# EAGLE design muxpmod (EAGLE 9.3.1)
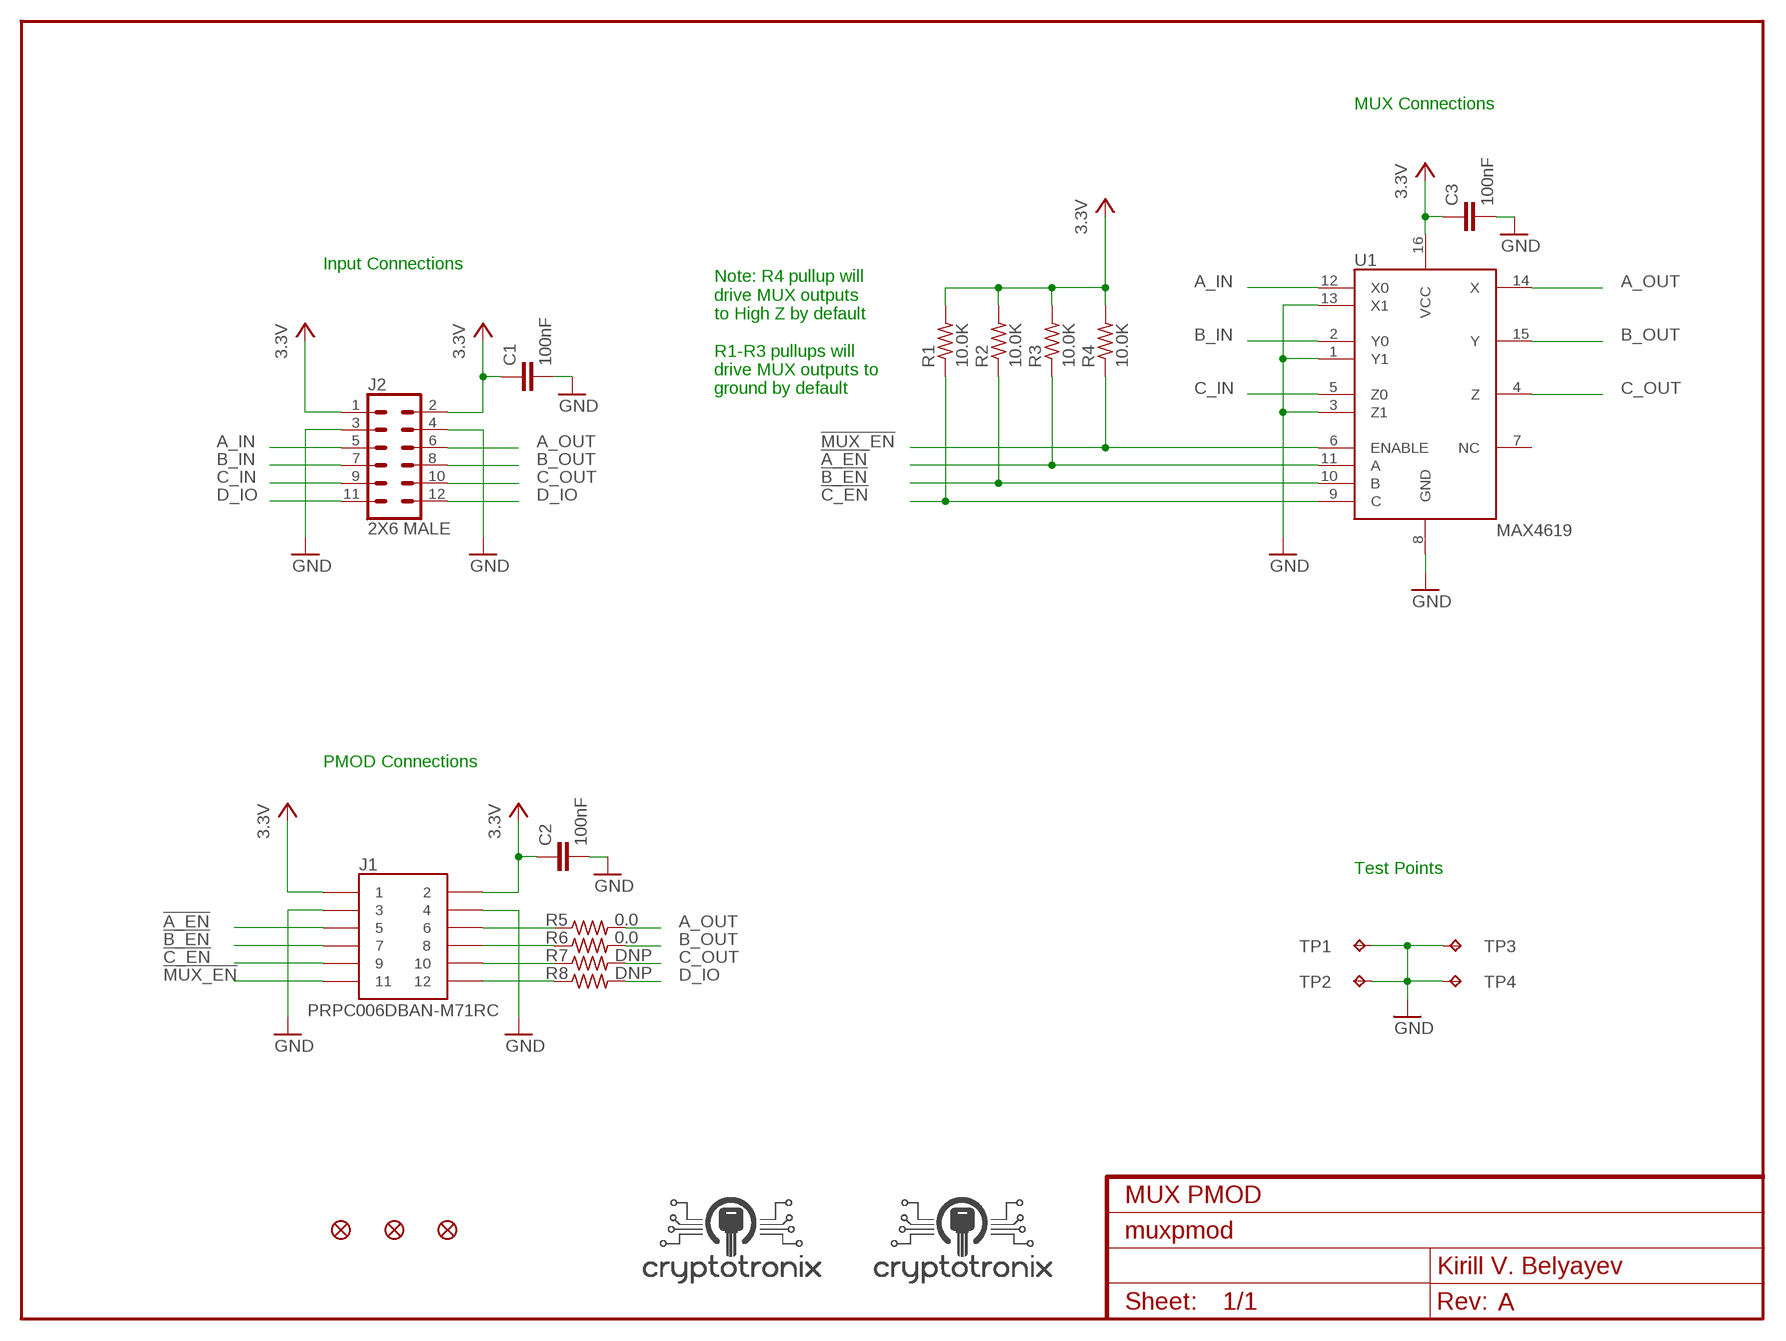
[diagram p0: schematic, sheet 1]
FRAME1 (FRAME-LETTER): CNAME: MUX PMOD; CREVISION: A; DESIGNER: Kirill V. Belyayev

## Parts
C1  100nF  C-EUC0603  [C0603]
C2  100nF  C-EUC0603  [C0603]
C3  100nF  C-EUC0603  [C0603]
FD1  FIDUCIALUFIDUCIAL  [MICRO-FIDUCIAL]
FD2  FIDUCIALUFIDUCIAL  [MICRO-FIDUCIAL]
FD3  FIDUCIALUFIDUCIAL  [MICRO-FIDUCIAL]
J1  PRPC006DBAN-M71RC  [PRPC006DBAN-M71RC]
J2  2X6 MALE  CONN_06X2PTH_FEMALE  [2X6]
LOGO1  CRYPTOTRONIX_LOGO_S  [CRYPTOTRONIX_LOGO_S]
LOGO2  CRYPTOTRONIX_LOGO_S  [CRYPTOTRONIX_LOGO_S]
R1  10.0K  R-US_R0603  [R0603]
R2  10.0K  R-US_R0603  [R0603]
R3  10.0K  R-US_R0603  [R0603]
R4  10.0K  R-US_R0603  [R0603]
R5  0.0  R-US_R0603  [R0603]
R6  0.0  R-US_R0603  [R0603]
R7  DNP  R-US_R0603  [R0603]
R8  DNP  R-US_R0603  [R0603]
TP1  TEST-POINT-SM  [5015]
TP2  TEST-POINT-SM  [5015]
TP3  TEST-POINT-SM  [5015]
TP4  TEST-POINT-SM  [5015]
U1  MAX4619  [16SOIC]

## Nets
0V: C1.2 C2.2 C3.2 J1.3 J1.4 J2.3 J2.4 TP1.1(PP) TP2.1(PP) TP3.1(PP) TP4.1(PP) U1.1(Y1) U1.3(Z1) U1.8(GND) U1.13(X1) ; supply symbol labelled GND
3.3V: C1.1 C2.1 C3.1 J1.1 J1.2 J2.1 J2.2 R1.2 R2.2 R3.2 R4.2 U1.16(VCC)
!A_EN: J1.5 R3.1 U1.11(A)
!B_EN: J1.7 R2.1 U1.10(B)
!C_EN: J1.9 R1.1 U1.9(C)
!MUX_EN: J1.11 R4.1 U1.6(ENABLE)
A_IN: J2.5 U1.12(X0)
A_OUT: J2.6 R5.2 U1.14(X)
B_IN: J2.7 U1.2(Y0)
B_OUT: J2.8 R6.2 U1.15(Y)
C_IN: J2.9 U1.5(Z0)
C_OUT: J2.10 R7.2 U1.4(Z)
D_IO: J2.11 J2.12 R8.2
N$1: J1.6 R5.1
N$2: J1.8 R6.1
N$3: J1.10 R7.1
N$4: J1.12 R8.1
Unconnected: U1.7(NC)

## Notes on the sheet
- MUX Connections
- Input Connections
- Note: R4 pullup will
  drive MUX outputs 
  to High Z by default
  
  R1-R3 pullups will
  drive MUX outputs to
  ground by default
- PMOD Connections
- Test Points

## Library data of the parts
C1-C3 = rcl:C-EU: CAPACITOR, European symbol; SPICEPREFIX: C
FD1-FD3 = KVB-misc:FIDUCIAL: Fiducial Alignment Points Various fiducial points for machine vision alignment.
J1 = KVB-connectors:PRPC006DBAN-M71RC: Connector Header Through Hole Right Angle 12 position 0.100" (2.54mm); MAN-PART_NUM: PRPC006DBAN-M71RC; MANUFACTURER: Sullins
J2 = SparkFun-Connectors:CONN_06X2: Multi connection point. Often used as Generic Header-pin footprint for 0.1 inch spaced/style header connections On any of the 0.1 inch spaced packages, you can populate with these: Break Away Headers - Straight <https://www.sparkfun.com/products/116> (PRT-00116) Break Away Male Headers - Right Angle <https://www.sparkfun.com/products/553> (PRT-00553) Female Headers <https://www.sparkfun.com/products/115> (PRT-00115) Break Away Headers - Machine Pin <https://www.sparkfun.com/products/117> (PRT-00117) Break Away Female Headers - Swiss Machine Pin <https://www.sparkfun.com/products/743> (PRT-00743); PROD_ID: CONN-12423; VALUE: 2X6 FEMALE
LOGO1 LOGO2 = KVB-misc:CRYPTOTRONIX_LOGO: Cryptotronix Logo
R1-R8 = rcl:R-US_: RESISTOR, American symbol; SPICEPREFIX: R
TP1-TP4 = KVB-misc:TEST-POINT: Various Test Points; MAN-PART_NUM: 5015; MANUFACTURER: KEYSTONE
U1 = KVB-ICs:MAX4619: IC MUX/SW TRIPLE LV SPDT 16-SOIC; MAN-PART_NUM: MAX4619CSE+; MANUFACTURER: Maxim Integrated

## Board
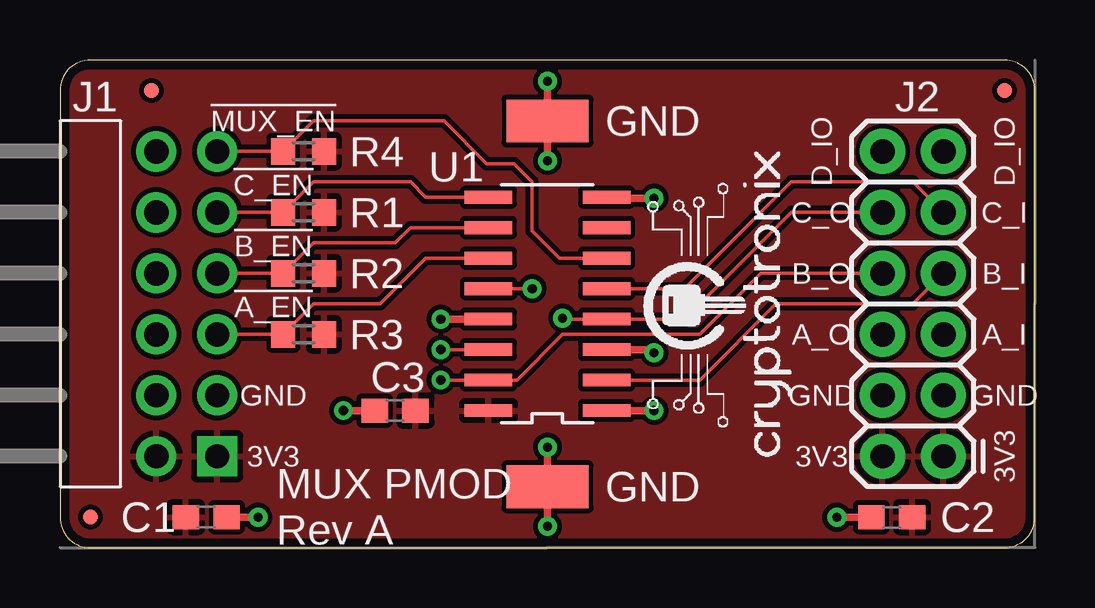
[diagram p1: board, top side]
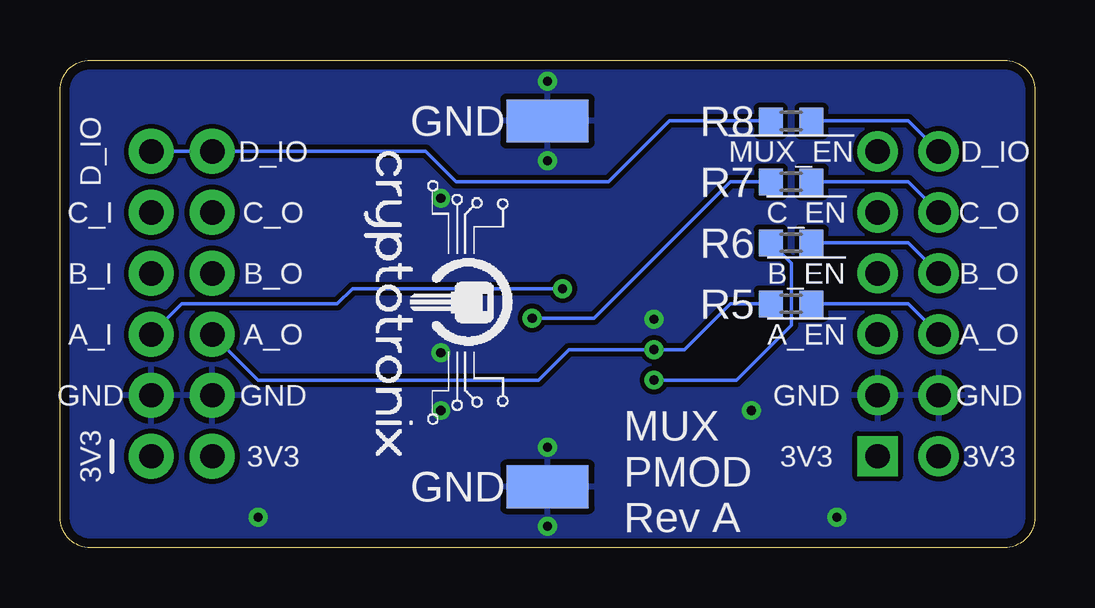
[diagram p2: board, bottom side, seen from below]

Size 40.64 x 20.32 mm. Coordinates in mm from the lower left corner, seen from the top.
Outline: 0,19.05 0,1.27 arc90 1.27,0 39.37,0 arc90 40.64,1.27 40.64,19.05 arc90 39.37,20.32 1.27,20.32 arc90 0,19.05
Copper layers (1*16): Top 0.035mm / dielectric 1.5mm / Bottom 0.035mm
Design rules "KVB-2layer": minimum track width 6mil, minimum drill 15mil, track to track 8mil, track to pad 8mil, pad to pad 8mil, via to via 8mil, smd to smd 8mil, copper to edge 15mil, drill to drill 8mil, minimum pad ring 10mil, minimum via ring 8mil, stop-mask expansion 3mil, vias tented up to drill 0mil, thermal gap 10mil

### Footprints (pad centres in the part's own frame; a part is rotated, then mirrored left to right if it is on the bottom)
C0603 = smd 1.1 x 1: 1 -0.85,0; 2 0.85,0
MICRO-FIDUCIAL = smd 0.635 x 0.635: 1 0,0
PRPC006DBAN-M71RC = drill 1.016 pad 1.676 square: 1 -6.553,6.35 | drill 1.016 pad 1.676: 2 -4.013,6.35; 3 -6.553,3.81; 4 -4.013,3.81; 5 -6.553,1.27; 6 -4.013,1.27; 7 -6.553,-1.27; 8 -4.013,-1.27; 9 -6.553,-3.81; 10 -4.013,-3.81; 11 -6.553,-6.35; 12 -4.013,-6.35
2X6 = drill 1.016 pad 1.88: 1 0,0; 2 0,2.54; 3 2.54,0; 4 2.54,2.54; 5 5.08,0; 6 5.08,2.54; 7 7.62,0; 8 7.62,2.54; 9 10.16,0; 10 10.16,2.54; 11 12.7,0; 12 12.7,2.54
R0603 = smd 1 x 1.1: 1 -0.85,0; 2 0.85,0
5015 = smd 1.778 x 3.429: 1 0,0
16SOIC = smd 1.981 x 0.533: 1 -2.464,4.445; 2 -2.464,3.175; 3 -2.464,1.905; 4 -2.464,0.635; 5 -2.464,-0.635; 6 -2.464,-1.905; 7 -2.464,-3.175; 8 -2.464,-4.445; 9 2.464,-4.445; 10 2.464,-3.175; 11 2.464,-1.905; 12 2.464,-0.635; 13 2.464,0.635; 14 2.464,1.905; 15 2.464,3.175; 16 2.464,4.445

### Placement (x,y rotation side)
C1  6.1,1.27 0 top
C2  34.67,1.27 180 top
C3  13.97,5.71 180 top
FD1  39.37,19.05 0 top
FD2  1.27,1.27 0 top
FD3  3.81,19.05 0 top
J1  0,10.16 180 top
J2  36.83,3.81 90 top
LOGO1  27.94,16.51 270 bottom
LOGO2  30.48,3.81 90 top
R1  10.16,13.97 0 top
R2  10.16,11.43 0 top
R3  10.16,8.89 0 top
R4  10.16,16.51 0 top
R5  10.16,10.16 180 bottom
R6  10.16,12.7 180 bottom
R7  10.16,15.24 180 bottom
R8  10.16,17.78 180 bottom
TP1  20.32,17.78 270 top
TP2  20.32,17.78 270 bottom
TP3  20.32,2.54 270 top
TP4  20.32,2.54 270 bottom
U1  20.32,10.16 180 top

### Tracks (layer width: path | path; a pad name or v marks a point on that pad's centre or on a via)
0V  (via drill 0.38)
  Top 0.305: U1.13 v15.88,9.53 | U1.1 v24.77,5.71 | v20.32,19.43 TP1.1 v20.32,16.13 | v20.32,0.89 TP3.1 v20.32,4.19 | C1.2 v8.26,1.27 | C2.2 v32.38,1.27 | C3.2 v11.81,5.71 | U1.8 22.75,14.57 v24.77,14.57 | v24.77,8.13 24.64,8.26 U1.3
  pour Bottom: -1.27,21.59 -1.27,-1.27 41.91,-1.27 41.91,21.59
3.3V
  pour Top: -2.54,22.86 -2.54,-2.54 43.18,-2.54 43.18,22.86
!A_EN
  Top 0.152: J1.5 R3.1 10.58,10.16 13.34,10.16 15.24,12.06 U1.11
!B_EN
  Top 0.152: J1.7 R2.1 10.58,12.7 13.97,12.7 14.61,13.34 U1.10
!C_EN
  Top 0.152: J1.9 R1.1 10.58,15.24 14.61,15.24 15.24,14.61 U1.9
!MUX_EN
  Top 0.152: J1.11 R4.1 10.58,17.78 16,17.78 17.78,16 18.92,16 19.68,15.24 19.68,13.21 20.83,12.06 U1.6
A_IN  (via drill 0.38)
  Top 0.152: U1.12 v19.68,10.79
  Bottom 0.152: J2.5 35.56,10.16 29.08,10.16 28.45,10.79 v19.68,10.79
A_OUT  (via drill 0.38)
  Top 0.152: U1.14 v15.88,8.26
  Bottom 0.152: J2.6 32.38,6.99 20.7,6.99 19.43,8.26 v15.88,8.26 14.61,8.26 12.7,10.16 R5.2
B_IN
  Top 0.152: J2.7 35.56,10.16 29.84,10.16 26.67,6.99 U1.2
B_OUT  (via drill 0.38)
  Top 0.152: J2.8 29.21,11.43 26.67,8.89 20.95,8.89 19.05,6.99 U1.15 v15.88,6.99
  Bottom 0.152: R6.2 10.16,11.85 10.16,9.27 12.45,6.99 v15.88,6.99
C_IN
  Top 0.152: J2.9 35.56,15.24 30.48,15.24 26.04,10.79 U1.5
C_OUT  (via drill 0.38)
  Top 0.152: J2.10 30.48,13.97 26.04,9.53 U1.4 20.99,9.53 v20.95,9.56
  Bottom 0.152: v20.95,9.56 18.38,9.56 12.7,15.24 R7.2
D_IO
  Bottom 0.152: R8.2 15.24,17.78 17.78,15.24 24.13,15.24 25.4,16.51 J2.12 J2.11
N$1
  Bottom 0.152: R5.1 5.28,10.16 J1.6
N$2
  Bottom 0.152: R6.1 5.28,12.7 J1.8
N$3
  Bottom 0.152: R7.1 5.28,15.24 J1.10
N$4
  Bottom 0.152: R8.1 5.28,17.78 J1.12

### Text on the board
tPlace: !MUX_EN | GND | D_IO | D_IO | !C_EN | C_O | C_I | !B_EN | B_O | B_I | !A_EN | A_O | A_I | GND | GND | GND | 3V3 | 3V3 | 3V3 | GND | MUX PMOD / Rev A
bPlace: D_IO | !MUX_EN | GND | D_IO | D_IO | C_O | !C_EN | C_O | C_I | B_O | !B_EN | B_O | B_I | A_O | !A_EN | A_O | A_I | GND | GND | GND | GND | 3V3 | 3V3 | 3V3 | 3V3 | GND | MUX / PMOD / Rev A